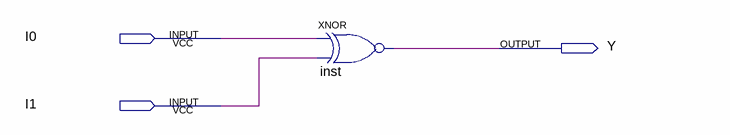
[diagram p0: schematic sheet]
// Quartus schematic Compare1bit.bdf as structural Verilog: 1 symbols, 3 pins
module Compare1bit (
  input  I0,
  input  I1,
  output Y
);

  xnor inst (Y, I0, I1);
endmodule
